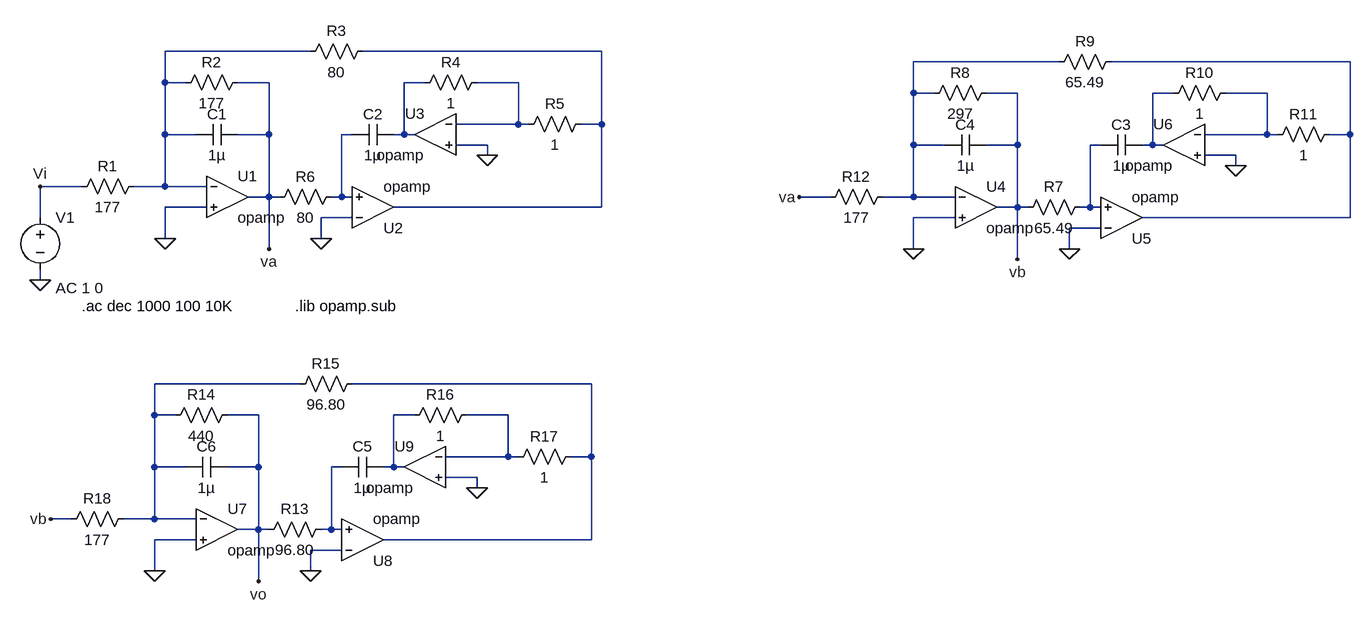
[diagram p0: schematic ej7tp2.asc]
ej7tp2.asc, the LTspice schematic file:
Version 4
SHEET 1 1784 1016
WIRE 176 96 -48 96
WIRE 624 96 256 96
WIRE 1328 112 1104 112
WIRE 1776 112 1408 112
WIRE -48 144 -48 96
WIRE -16 144 -48 144
WIRE 112 144 64 144
WIRE 352 144 320 144
WIRE 496 144 432 144
WIRE 1104 160 1104 112
WIRE 1136 160 1104 160
WIRE 1264 160 1216 160
WIRE 1504 160 1472 160
WIRE 1648 160 1584 160
WIRE 496 208 496 144
WIRE 496 208 400 208
WIRE 512 208 496 208
WIRE 624 208 624 96
WIRE 624 208 592 208
WIRE -48 224 -48 144
WIRE 0 224 -48 224
WIRE 112 224 112 144
WIRE 112 224 64 224
WIRE 240 224 224 224
WIRE 320 224 320 144
WIRE 320 224 304 224
WIRE 336 224 320 224
WIRE 1648 224 1648 160
WIRE 1648 224 1552 224
WIRE 1664 224 1648 224
WIRE 1776 224 1776 112
WIRE 1776 224 1744 224
WIRE 448 240 400 240
WIRE 1104 240 1104 160
WIRE 1152 240 1104 240
WIRE 1264 240 1264 160
WIRE 1264 240 1216 240
WIRE 1392 240 1376 240
WIRE 1472 240 1472 160
WIRE 1472 240 1456 240
WIRE 1488 240 1472 240
WIRE 448 256 448 240
WIRE 1600 256 1552 256
WIRE 1600 272 1600 256
WIRE -176 304 -240 304
WIRE -48 304 -48 224
WIRE -48 304 -96 304
WIRE 16 304 -48 304
WIRE 112 320 112 224
WIRE 112 320 80 320
WIRE 128 320 112 320
WIRE 224 320 224 224
WIRE 224 320 208 320
WIRE 240 320 224 320
WIRE 976 320 928 320
WIRE 1104 320 1104 240
WIRE 1104 320 1056 320
WIRE 1168 320 1104 320
WIRE 16 336 -48 336
WIRE 624 336 624 208
WIRE 624 336 304 336
WIRE 1264 336 1264 240
WIRE 1264 336 1232 336
WIRE 1280 336 1264 336
WIRE 1376 336 1376 240
WIRE 1376 336 1360 336
WIRE 1392 336 1376 336
WIRE -240 352 -240 304
WIRE 240 352 192 352
WIRE 1168 352 1104 352
WIRE 1776 352 1776 224
WIRE 1776 352 1456 352
WIRE 1392 368 1344 368
WIRE -48 384 -48 336
WIRE 192 384 192 352
WIRE 112 400 112 320
WIRE 1104 400 1104 352
WIRE 1344 400 1344 368
WIRE 1264 416 1264 336
WIRE -240 448 -240 432
WIRE 160 608 -64 608
WIRE 608 608 240 608
WIRE -64 656 -64 608
WIRE -32 656 -64 656
WIRE 96 656 48 656
WIRE 336 656 304 656
WIRE 480 656 416 656
WIRE 480 720 480 656
WIRE 480 720 384 720
WIRE 496 720 480 720
WIRE 608 720 608 608
WIRE 608 720 576 720
WIRE -64 736 -64 656
WIRE -16 736 -64 736
WIRE 96 736 96 656
WIRE 96 736 48 736
WIRE 224 736 208 736
WIRE 304 736 304 656
WIRE 304 736 288 736
WIRE 320 736 304 736
WIRE 432 752 384 752
WIRE 432 768 432 752
WIRE -192 816 -224 816
WIRE -64 816 -64 736
WIRE -64 816 -112 816
WIRE 0 816 -64 816
WIRE 96 832 96 736
WIRE 96 832 64 832
WIRE 112 832 96 832
WIRE 208 832 208 736
WIRE 208 832 192 832
WIRE 224 832 208 832
WIRE 0 848 -64 848
WIRE 608 848 608 720
WIRE 608 848 288 848
WIRE 224 864 176 864
WIRE -64 896 -64 848
WIRE 176 896 176 864
WIRE 96 912 96 832
FLAG 448 256 0
FLAG -240 448 0
FLAG -48 384 0
FLAG 192 384 0
FLAG -240 304 Vi
FLAG 112 400 va
FLAG 1600 272 0
FLAG 1104 400 0
FLAG 1344 400 0
FLAG 928 320 va
FLAG 1264 416 vb
FLAG 432 768 0
FLAG -64 896 0
FLAG 176 896 0
FLAG 96 912 vo
FLAG -224 816 vb
SYMBOL OpAmps\\opamp 48 256 R0
SYMATTR InstName U1
SYMBOL OpAmps\\opamp 272 400 M180
SYMATTR InstName U2
SYMBOL res 224 304 R90
WINDOW 0 0 56 VBottom 2
WINDOW 3 32 56 VTop 2
SYMATTR InstName R6
SYMATTR Value 80
SYMBOL OpAmps\\opamp 368 160 M0
SYMATTR InstName U3
SYMBOL cap 304 208 R90
WINDOW 0 0 32 VBottom 2
WINDOW 3 32 32 VTop 2
SYMATTR InstName C2
SYMATTR Value 1µ
SYMBOL voltage -240 336 R0
WINDOW 123 24 124 Left 2
WINDOW 39 0 0 Left 0
SYMATTR Value2 AC 1 0
SYMATTR InstName V1
SYMATTR Value ""
SYMBOL cap 64 208 R90
WINDOW 0 0 32 VBottom 2
WINDOW 3 32 32 VTop 2
SYMATTR InstName C1
SYMATTR Value 1µ
SYMBOL res 80 128 R90
WINDOW 0 0 56 VBottom 2
WINDOW 3 32 56 VTop 2
SYMATTR InstName R2
SYMATTR Value 177
SYMBOL res 272 80 R90
WINDOW 0 0 56 VBottom 2
WINDOW 3 32 56 VTop 2
SYMATTR InstName R3
SYMATTR Value 80
SYMBOL res 448 128 R90
WINDOW 0 0 56 VBottom 2
WINDOW 3 32 56 VTop 2
SYMATTR InstName R4
SYMATTR Value 1
SYMBOL res 608 192 R90
WINDOW 0 0 56 VBottom 2
WINDOW 3 32 56 VTop 2
SYMATTR InstName R5
SYMATTR Value 1
SYMBOL res -80 288 R90
WINDOW 0 0 56 VBottom 2
WINDOW 3 32 56 VTop 2
SYMATTR InstName R1
SYMATTR Value 177
SYMBOL OpAmps\\opamp 1200 272 R0
SYMATTR InstName U4
SYMBOL OpAmps\\opamp 1424 416 M180
SYMATTR InstName U5
SYMBOL res 1376 320 R90
WINDOW 0 0 56 VBottom 2
WINDOW 3 32 56 VTop 2
SYMATTR InstName R7
SYMATTR Value 65.49
SYMBOL OpAmps\\opamp 1520 176 M0
SYMATTR InstName U6
SYMBOL cap 1456 224 R90
WINDOW 0 0 32 VBottom 2
WINDOW 3 32 32 VTop 2
SYMATTR InstName C3
SYMATTR Value 1µ
SYMBOL cap 1216 224 R90
WINDOW 0 0 32 VBottom 2
WINDOW 3 32 32 VTop 2
SYMATTR InstName C4
SYMATTR Value 1µ
SYMBOL res 1232 144 R90
WINDOW 0 0 56 VBottom 2
WINDOW 3 32 56 VTop 2
SYMATTR InstName R8
SYMATTR Value 297
SYMBOL res 1424 96 R90
WINDOW 0 0 56 VBottom 2
WINDOW 3 32 56 VTop 2
SYMATTR InstName R9
SYMATTR Value 65.49
SYMBOL res 1600 144 R90
WINDOW 0 0 56 VBottom 2
WINDOW 3 32 56 VTop 2
SYMATTR InstName R10
SYMATTR Value 1
SYMBOL res 1760 208 R90
WINDOW 0 0 56 VBottom 2
WINDOW 3 32 56 VTop 2
SYMATTR InstName R11
SYMATTR Value 1
SYMBOL res 1072 304 R90
WINDOW 0 0 56 VBottom 2
WINDOW 3 32 56 VTop 2
SYMATTR InstName R12
SYMATTR Value 177
SYMBOL OpAmps\\opamp 32 768 R0
SYMATTR InstName U7
SYMBOL OpAmps\\opamp 256 912 M180
SYMATTR InstName U8
SYMBOL res 208 816 R90
WINDOW 0 0 56 VBottom 2
WINDOW 3 32 56 VTop 2
SYMATTR InstName R13
SYMATTR Value 96.80
SYMBOL OpAmps\\opamp 352 672 M0
SYMATTR InstName U9
SYMBOL cap 288 720 R90
WINDOW 0 0 32 VBottom 2
WINDOW 3 32 32 VTop 2
SYMATTR InstName C5
SYMATTR Value 1µ
SYMBOL cap 48 720 R90
WINDOW 0 0 32 VBottom 2
WINDOW 3 32 32 VTop 2
SYMATTR InstName C6
SYMATTR Value 1µ
SYMBOL res 64 640 R90
WINDOW 0 0 56 VBottom 2
WINDOW 3 32 56 VTop 2
SYMATTR InstName R14
SYMATTR Value 440
SYMBOL res 256 592 R90
WINDOW 0 0 56 VBottom 2
WINDOW 3 32 56 VTop 2
SYMATTR InstName R15
SYMATTR Value 96.80
SYMBOL res 432 640 R90
WINDOW 0 0 56 VBottom 2
WINDOW 3 32 56 VTop 2
SYMATTR InstName R16
SYMATTR Value 1
SYMBOL res 592 704 R90
WINDOW 0 0 56 VBottom 2
WINDOW 3 32 56 VTop 2
SYMATTR InstName R17
SYMATTR Value 1
SYMBOL res -96 800 R90
WINDOW 0 0 56 VBottom 2
WINDOW 3 32 56 VTop 2
SYMATTR InstName R18
SYMATTR Value 177
TEXT 152 488 Left 2 !.lib opamp.sub
TEXT -176 488 Left 2 !.ac dec 1000 100 10K

The netlist it stands for:
* ej7tp2.asc
XU1 N001 0 va opamp Aol=100K GBW=10Meg  ; pins invin noninvin out
XU2 0 N009 N002 opamp Aol=100K GBW=10Meg  ; pins invin noninvin out
R6 N009 va 80
XU3 N006 0 N005 opamp Aol=100K GBW=10Meg  ; pins invin noninvin out
C2 N005 N009 1µ
V1 Vi 0 AC 1 0
C1 va N001 1µ
R2 va N001 177
R3 N002 N001 80
R4 N006 N005 1
R5 N002 N006 1
R1 N001 Vi 177
XU4 N003 0 vb opamp Aol=100K GBW=10Meg  ; pins invin noninvin out
XU5 0 N010 N004 opamp Aol=100K GBW=10Meg  ; pins invin noninvin out
R7 N010 vb 65.49
XU6 N008 0 N007 opamp Aol=100K GBW=10Meg  ; pins invin noninvin out
C3 N007 N010 1µ
C4 vb N003 1µ
R8 vb N003 297
R9 N004 N003 65.49
R10 N008 N007 1
R11 N004 N008 1
R12 N003 va 177
XU7 N011 0 vo opamp Aol=100K GBW=10Meg  ; pins invin noninvin out
XU8 0 N015 N012 opamp Aol=100K GBW=10Meg  ; pins invin noninvin out
R13 N015 vo 96.80
XU9 N014 0 N013 opamp Aol=100K GBW=10Meg  ; pins invin noninvin out
C5 N013 N015 1µ
C6 vo N011 1µ
R14 vo N011 440
R15 N012 N011 96.80
R16 N014 N013 1
R17 N012 N014 1
R18 N011 vb 177
.lib opamp.sub
.ac dec 1000 100 10K
.backanno
.end